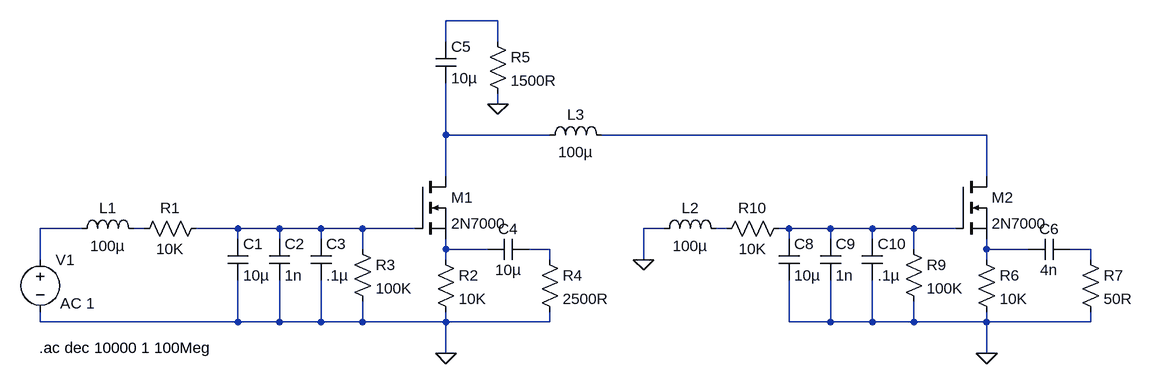
[diagram p0: schematic Dual FET Switch Analysis.asc]
Dual FET Switch Analysis.asc, the LTspice schematic file:
Version 4
SHEET 1 1608 680
WIRE 80 -208 0 -208
WIRE 0 -176 0 -208
WIRE 80 -176 80 -208
WIRE 80 -80 80 -96
WIRE 0 -32 0 -112
WIRE 160 -32 0 -32
WIRE 832 -32 240 -32
WIRE 0 32 0 -32
WIRE 832 32 832 -32
WIRE -560 112 -624 112
WIRE -464 112 -480 112
WIRE -320 112 -384 112
WIRE -256 112 -320 112
WIRE -192 112 -256 112
WIRE -128 112 -192 112
WIRE -48 112 -128 112
WIRE 336 112 304 112
WIRE 432 112 416 112
WIRE 528 112 512 112
WIRE 592 112 528 112
WIRE 656 112 592 112
WIRE 720 112 656 112
WIRE 784 112 720 112
WIRE -320 128 -320 112
WIRE -256 128 -256 112
WIRE -192 128 -192 112
WIRE 528 128 528 112
WIRE 592 128 592 112
WIRE 656 128 656 112
WIRE -128 144 -128 112
WIRE 0 144 0 128
WIRE 64 144 0 144
WIRE 160 144 128 144
WIRE 720 144 720 112
WIRE 832 144 832 128
WIRE 896 144 832 144
WIRE 992 144 960 144
WIRE -624 160 -624 112
WIRE 0 160 0 144
WIRE 160 160 160 144
WIRE 304 160 304 112
WIRE 832 160 832 144
WIRE 992 160 992 144
WIRE -624 256 -624 240
WIRE -320 256 -320 192
WIRE -320 256 -624 256
WIRE -256 256 -256 192
WIRE -256 256 -320 256
WIRE -192 256 -192 192
WIRE -192 256 -256 256
WIRE -128 256 -128 224
WIRE -128 256 -192 256
WIRE 0 256 0 240
WIRE 0 256 -128 256
WIRE 160 256 160 240
WIRE 160 256 0 256
WIRE 528 256 528 192
WIRE 592 256 592 192
WIRE 592 256 528 256
WIRE 656 256 656 192
WIRE 656 256 592 256
WIRE 720 256 720 224
WIRE 720 256 656 256
WIRE 832 256 832 240
WIRE 832 256 720 256
WIRE 992 256 992 240
WIRE 992 256 832 256
WIRE 0 304 0 256
WIRE 832 304 832 256
FLAG 0 304 0
FLAG 80 -80 0
FLAG 832 304 0
FLAG 304 160 0
SYMBOL voltage -624 144 R0
WINDOW 123 31 83 Left 2
WINDOW 39 0 0 Left 2
SYMATTR InstName V1
SYMATTR Value ""
SYMATTR Value2 AC 1
SYMBOL ind -576 128 R270
WINDOW 0 32 56 VTop 2
WINDOW 3 5 56 VBottom 2
SYMATTR InstName L1
SYMATTR Value 100µ
SYMBOL res -368 96 R90
WINDOW 0 0 56 VBottom 2
WINDOW 3 32 56 VTop 2
SYMATTR InstName R1
SYMATTR Value 10K
SYMBOL cap -336 128 R0
SYMATTR InstName C1
SYMATTR Value 10µ
SYMBOL cap -272 128 R0
SYMATTR InstName C2
SYMATTR Value 1n
SYMBOL cap -208 128 R0
SYMATTR InstName C3
SYMATTR Value .1µ
SYMBOL nmos -48 32 R0
SYMATTR InstName M1
SYMATTR Value 2N7000
SYMBOL res -16 144 R0
SYMATTR InstName R2
SYMATTR Value 10K
SYMBOL res -144 128 R0
SYMATTR InstName R3
SYMATTR Value 100K
SYMBOL cap 128 128 R90
WINDOW 0 0 32 VBottom 2
WINDOW 3 32 32 VTop 2
SYMATTR InstName C4
SYMATTR Value 10µ
SYMBOL res 144 144 R0
SYMATTR InstName R4
SYMATTR Value 2500R
SYMBOL res 64 -192 R0
SYMATTR InstName R5
SYMATTR Value 1500R
SYMBOL cap -16 -176 R0
SYMATTR InstName C5
SYMATTR Value 10µ
SYMBOL nmos 784 32 R0
SYMATTR InstName M2
SYMATTR Value 2N7000
SYMBOL res 816 144 R0
SYMATTR InstName R6
SYMATTR Value 10K
SYMBOL cap 960 128 R90
WINDOW 0 0 32 VBottom 2
WINDOW 3 32 32 VTop 2
SYMATTR InstName C6
SYMATTR Value 4n
SYMBOL res 976 144 R0
SYMATTR InstName R7
SYMATTR Value 50R
SYMBOL ind 320 128 R270
WINDOW 0 32 56 VTop 2
WINDOW 3 5 56 VBottom 2
SYMATTR InstName L2
SYMATTR Value 100µ
SYMBOL res 528 96 R90
WINDOW 0 0 56 VBottom 2
WINDOW 3 32 56 VTop 2
SYMATTR InstName R10
SYMATTR Value 10K
SYMBOL cap 512 128 R0
SYMATTR InstName C8
SYMATTR Value 10µ
SYMBOL cap 576 128 R0
SYMATTR InstName C9
SYMATTR Value 1n
SYMBOL cap 640 128 R0
SYMATTR InstName C10
SYMATTR Value .1µ
SYMBOL res 704 128 R0
SYMATTR InstName R9
SYMATTR Value 100K
SYMBOL ind 144 -16 R270
WINDOW 0 32 56 VTop 2
WINDOW 3 5 56 VBottom 2
SYMATTR InstName L3
SYMATTR Value 100µ
TEXT -626 296 Left 2 !.ac dec 10000 1 100Meg

The netlist it stands for:
* Dual FET Switch Analysis.asc
V1 N004 0 AC 1
L1 N004 N005 100µ
R1 N006 N005 10K
C1 N006 0 10µ
C2 N006 0 1n
C3 N006 0 .1µ
M1 N002 N006 N009 N009 2N7000
R2 N009 0 10K
R3 N006 0 100K
C4 N010 N009 10µ
R4 N010 0 2500R
R5 N001 0 1500R
C5 N001 N002 10µ
M2 N003 N008 N011 N011 2N7000
R6 N011 0 10K
C6 N012 N011 4n
R7 N012 0 50R
L2 0 N007 100µ
R10 N008 N007 10K
C8 N008 0 10µ
C9 N008 0 1n
C10 N008 0 .1µ
R9 N008 0 100K
L3 N002 N003 100µ
.model NMOS NMOS
.model PMOS PMOS
.lib standard.mos
.ac dec 10000 1 100Meg
.backanno
.end